# EAGLE design Push-It-V1.0 (EAGLE 9.4.2)
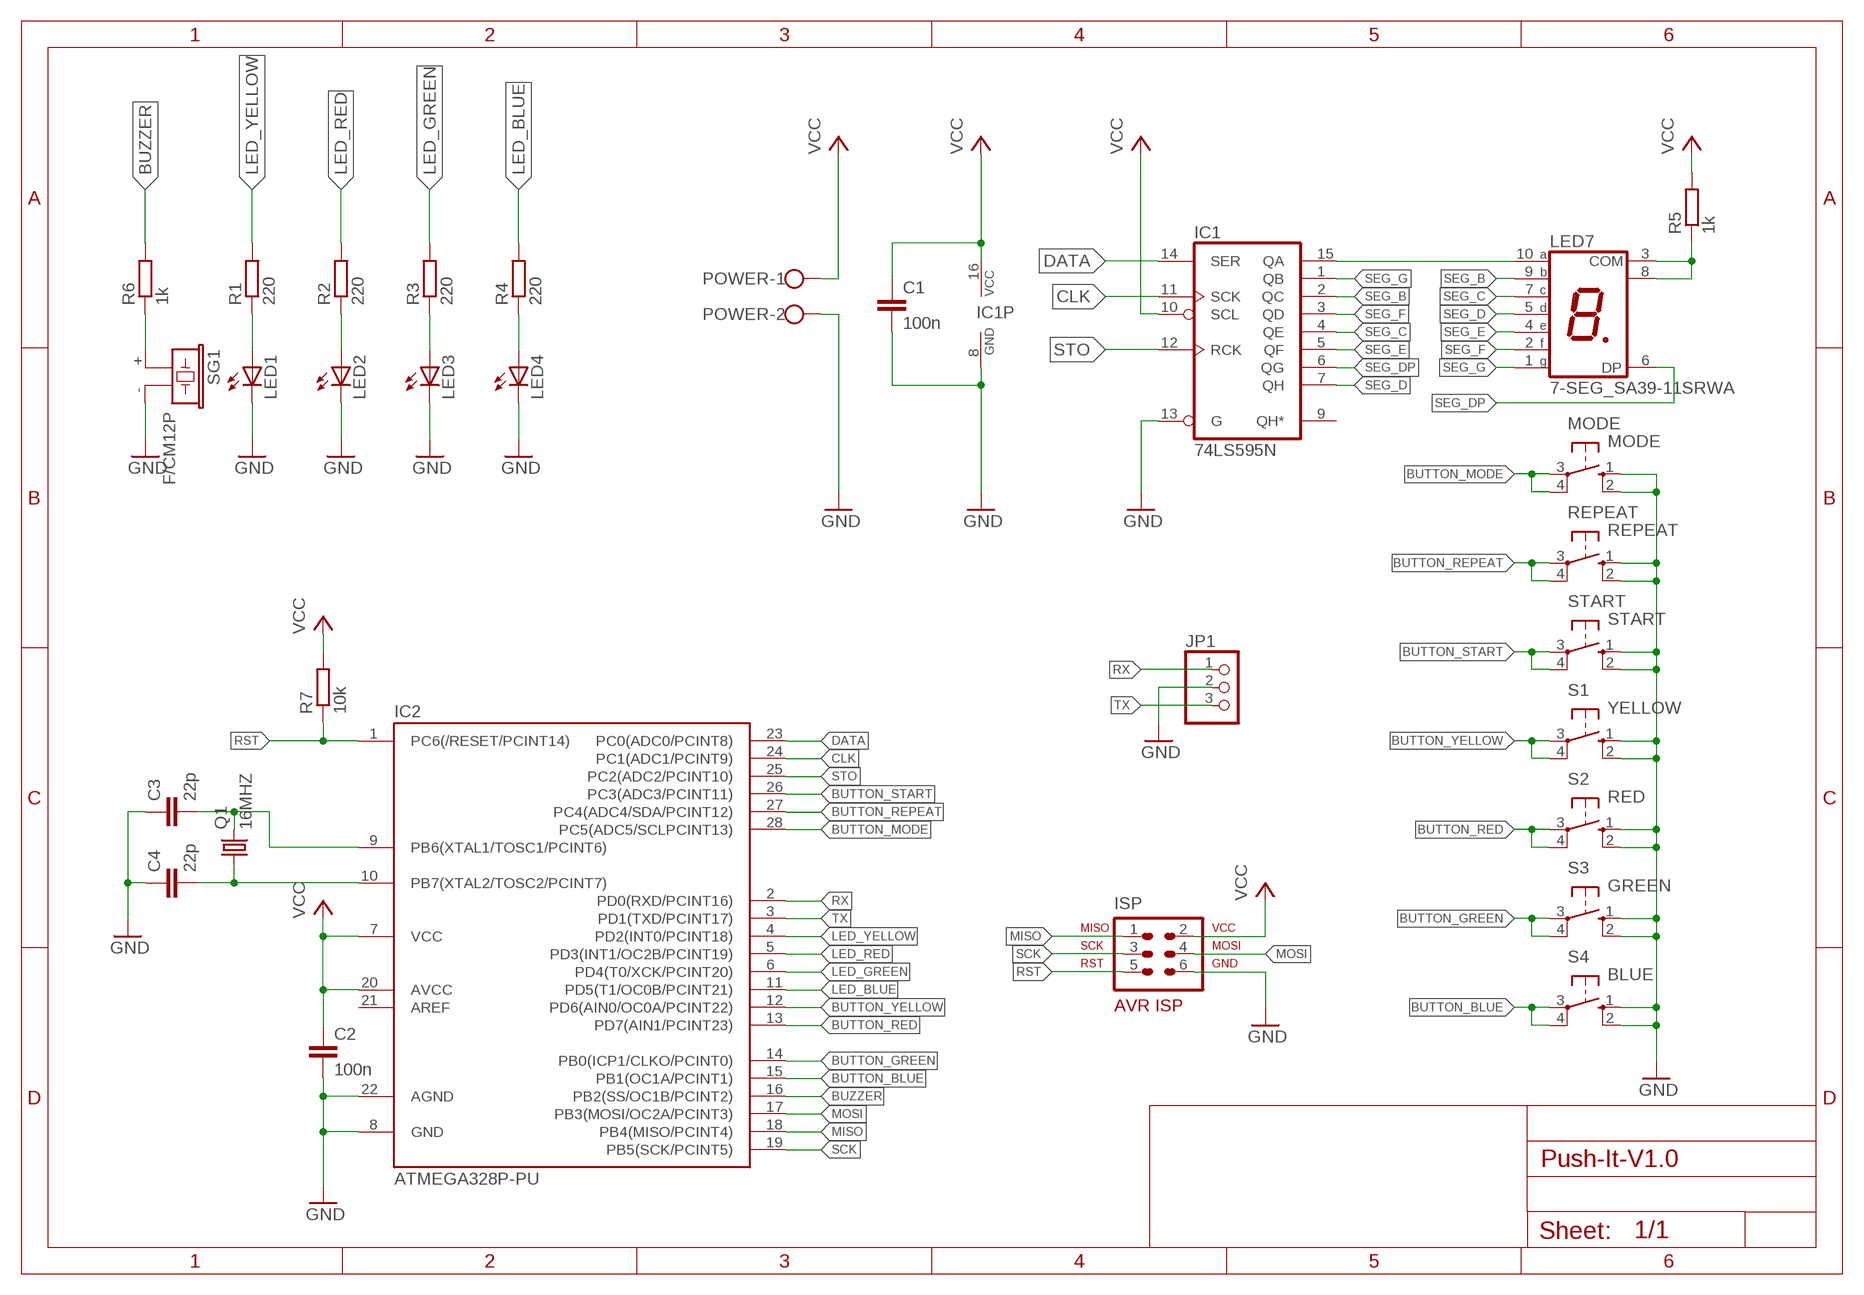
[diagram p0: schematic, sheet 1]

## Parts
C1  100n  C-EU025-025X050  [C025-025X050]
C2  100n  C-EU025-025X050  [C025-025X050]
C3  22p  C-EU025-025X050  [C025-025X050]
C4  22p  C-EU025-025X050  [C025-025X050]
IC1  74LS595N  [DIL16]
IC2  ATMEGA328P-PU  MEGA48/88/168-PU  [DIL28-3]
ISP  AVR-ISP-6VERT  [AVR-ISP-6]
JP1  PINHD-1X3/90  [1X03/90]
LED1  LED10MM  [LED10MM]
LED2  LED10MM  [LED10MM]
LED3  LED10MM  [LED10MM]
LED4  LED10MM  [LED10MM]
LED7  7-SEG_SA39-11SRWA  [SA39-11SRWA]
MODE  MODE  10-XX  [B3F-10XX]
POWER  W237-102  [W237-102]
Q1  16MHZ  CRYSTALHC49S  [HC49/S]
R1  220  R-EU_0207/7  [0207/7]
R2  220  R-EU_0207/7  [0207/7]
R3  220  R-EU_0207/7  [0207/7]
R4  220  R-EU_0207/7  [0207/7]
R5  1k  R-EU_0207/7  [0207/7]
R6  1k  R-EU_0207/7  [0207/7]
R7  10k  R-EU_0207/7  [0207/7]
REPEAT  REPEAT  10-XX  [B3F-10XX]
S1  YELLOW  10-XX  [B3F-10XX]
S2  RED  10-XX  [B3F-10XX]
S3  GREEN  10-XX  [B3F-10XX]
S4  BLUE  10-XX  [B3F-10XX]
SG1  F/CM12P  [F/CM12P]
START  START  10-XX  [B3F-10XX]

## Nets
BUTTON_BLUE: IC2.15(PB1(OC1A/PCINT1)) S4.3(P) S4.4(P1)
BUTTON_GREEN: IC2.14(PB0(ICP1/CLKO/PCINT0)) S3.3(P) S3.4(P1)
BUTTON_MODE: IC2.28(PC5(ADC5/SCLPCINT13)) MODE.3(P) MODE.4(P1)
BUTTON_RED: IC2.13(PD7(AIN1/PCINT23)) S2.3(P) S2.4(P1)
BUTTON_REPEAT: IC2.27(PC4(ADC4/SDA/PCINT12)) REPEAT.3(P) REPEAT.4(P1)
BUTTON_START: IC2.26(PC3(ADC3/PCINT11)) START.3(P) START.4(P1)
BUTTON_YELLOW: IC2.12(PD6(AIN0/OC0A/PCINT22)) S1.3(P) S1.4(P1)
BUZZER: IC2.16(PB2(SS/OC1B/PCINT2)) R6.2
CLK: IC1.11(SCK) IC2.24(PC1(ADC1/PCINT9))
DATA: IC1.14(SER) IC2.23(PC0(ADC0/PCINT8))
GND: C1.2 C2.2 C3.1 C4.1 IC1.8(GND) IC1.13(G) IC2.8(GND) IC2.22(AGND) ISP.6 JP1.2 LED1.K(C) LED2.K(C) LED3.K(C) LED4.K(C) MODE.1(S) MODE.2(S1) POWER.2 REPEAT.1(S) REPEAT.2(S1) S1.1(S) S1.2(S1) S2.1(S) S2.2(S1) S3.1(S) S3.2(S1) S4.1(S) S4.2(S1) SG1.- START.1(S) START.2(S1)
LED_BLUE: IC2.11(PD5(T1/OC0B/PCINT21)) R4.2
LED_GREEN: IC2.6(PD4(T0/XCK/PCINT20)) R3.2
LED_RED: IC2.5(PD3(INT1/OC2B/PCINT19)) R2.2
LED_YELLOW: IC2.4(PD2(INT0/PCINT18)) R1.2
MISO: IC2.18(PB4(MISO/PCINT4)) ISP.1
MOSI: IC2.17(PB3(MOSI/OC2A/PCINT3)) ISP.4
N$1: LED1.A R1.1
N$2: LED2.A R2.1
N$3: LED3.A R3.1
N$4: LED4.A R4.1
N$5: IC1.15(QA) LED7.10(A)
N$13: LED7.3(COM) LED7.8(COM) R5.1
N$14: C4.2 IC2.10(PB7(XTAL2/TOSC2/PCINT7)) Q1.1
N$15: C3.2 IC2.9(PB6(XTAL1/TOSC1/PCINT6)) Q1.2
N$16: R6.1 SG1.+
RST: IC2.1(PC6(/RESET/PCINT14)) ISP.5 R7.1
RX: IC2.2(PD0(RXD/PCINT16)) JP1.1
SCK: IC2.19(PB5(SCK/PCINT5)) ISP.3
SEG_B: IC1.2(QC) LED7.9(B)
SEG_C: IC1.4(QE) LED7.7(C)
SEG_D: IC1.7(QH) LED7.5(D)
SEG_DP: IC1.6(QG) LED7.6(DP)
SEG_E: IC1.5(QF) LED7.4(E)
SEG_F: IC1.3(QD) LED7.2(F)
SEG_G: IC1.1(QB) LED7.1(G)
STO: IC1.12(RCK) IC2.25(PC2(ADC2/PCINT10))
TX: IC2.3(PD1(TXD/PCINT17)) JP1.3
VCC: C1.1 C2.1 IC1.10(SCL) IC1.16(VCC) IC2.7(VCC) IC2.20(AVCC) ISP.2 POWER.1 R5.2 R7.2
Unconnected: IC1.9(QH*) IC2.21(AREF)

## Library data of the parts
C1-C4 = rcl:C-EU: CAPACITOR, European symbol
IC1 = 74xx-eu:74*595: 8-bit SHIFT REGISTER, output latch
IC2 = avr-6:MEGA48/88/168-PU
ISP = avr-7:AVR-ISP-6: AVR ISP-6 Serial Programming Header
JP1 = pinhead:PINHD-1X3: PIN HEADER
LED1-LED4 = led:LED: LED OSRAM: - CHIPLED LG R971, LG N971, LY N971, LG Q971, LY Q971, LO R971, LY R971 LH N974, LH R974 LS Q976, LO Q976, LY Q976 LO Q996 - Hyper CHIPLED LW Q18S LB Q993, LB Q99A, LB R99A - SideLED LS A670, LO A670, LY A670, LG A670, LP A670 LB A673, LV A673, LT A673, LW A673 LH A674 LY A675 LS A676, LA A676, LO A676, LY A676, LW A676 LS A679, LY A679, LG A679 - Hyper Micro SIDELED® LS Y876, LA Y876, LO Y876, LY Y876 LT Y87S - SmartLED LW L88C, LW L88S LB L89C, LB L89S, LG L890 LS L89K, LO L89K, LY L89K LS L896, LA L896, LO L896, LY L896 - TOPLED LS T670, LO T670, LY T670, LG T670, LP T670 LSG T670, LSP T670, LSY T670, LOP T670, LYG T670 LG T671, LOG T671, LSG T671 LB T673, LV T673, LT T673, LW T673 LH T674 LS T676, LA T676, LO T676, LY T676, LB T676, LH T676, LSB T676, LW T676 LB T67C, LV T67C, LT T67C, LS T67K, LO T67K, LY T67K, LW E67C LS E67B, LA E67B, LO E67B, LY E67B, LB E67C, LV E67C, LT E67C LW T67C LS T679, LY T679, LG T679 LS T770, LO T770, LY T770, LG T770, LP T770 LB T773, LV T773, LT T773, LW T773 LH T774 LS E675, LA E675, LY E675, LS T675 LS T776, LA T776, LO T776, LY T776, LB T776 LHGB T686 LT T68C, LB T68C - Hyper Mini TOPLED® LB M676 - Mini TOPLED Santana® LG M470 LS M47K, LO M47K, LY M47K Source: http://www.osram.convergy.de LUXEON: - LUMILED® LXK2-PW12-R00, LXK2-PW12-S00, LXK2-PW14-U00, LXK2-PW14-V00 LXK2-PM12-R00, LXK2-PM12-S00, LXK2-PM14-U00 LXK2-PE12-Q00, LXK2-PE12-R00, LXK2-PE12-S00, LXK2-PE14-T00, LXK2-PE14-U00 LXK2-PB12-K00, LXK2-PB12-L00, LXK2-PB12-M00, LXK2-PB14-N00, LXK2-PB14-P00, LXK2-PB14-Q00 LXK2-PR12-L00, LXK2-PR12-M00, LXK2-PR14-Q00, LXK2-PR14-R00 LXK2-PD12-Q00, LXK2-PD12-R00, LXK2-PD12-S00 LXK2-PH12-R00, LXK2-PH12-S00 LXK2-PL12-P00, LXK2-PL12-Q00, LXK2-PL12-R00 Source: www.luxeon.com KINGBRIGHT: KA-3528ASYC Source: www.kingbright.com
LED7 = display-kingbright-2:7-SEG_: Kingbright 14.2mm (0.56 INCH) SINGLE DIGIT NUMERIC DUISPLAY Source: SA56-11EWA(Ver1189471036.pdf
MODE REPEAT S1-S4 START = switch-omron:10-XX: OMRON SWITCH; MPN: B3F-1000; OC_FARNELL: 176432; OC_NEWARK: 36M3542
POWER = con-wago-500:W237-102: WAGO SCREW CLAMP; MPN: 237-102; OC_FARNELL: unknown; OC_NEWARK: 70K9898
Q1 = crystal:CRYSTAL: CRYSTAL; OC_FARNELL: 1667008; OC_NEWARK: unknown
R1-R7 = rcl:R-EU_: RESISTOR, European symbol
SG1 = buzzer:F/CM12P: BUZZER Source: Buerklin; OC_FARNELL: unknown; OC_NEWARK: unknown

## Board
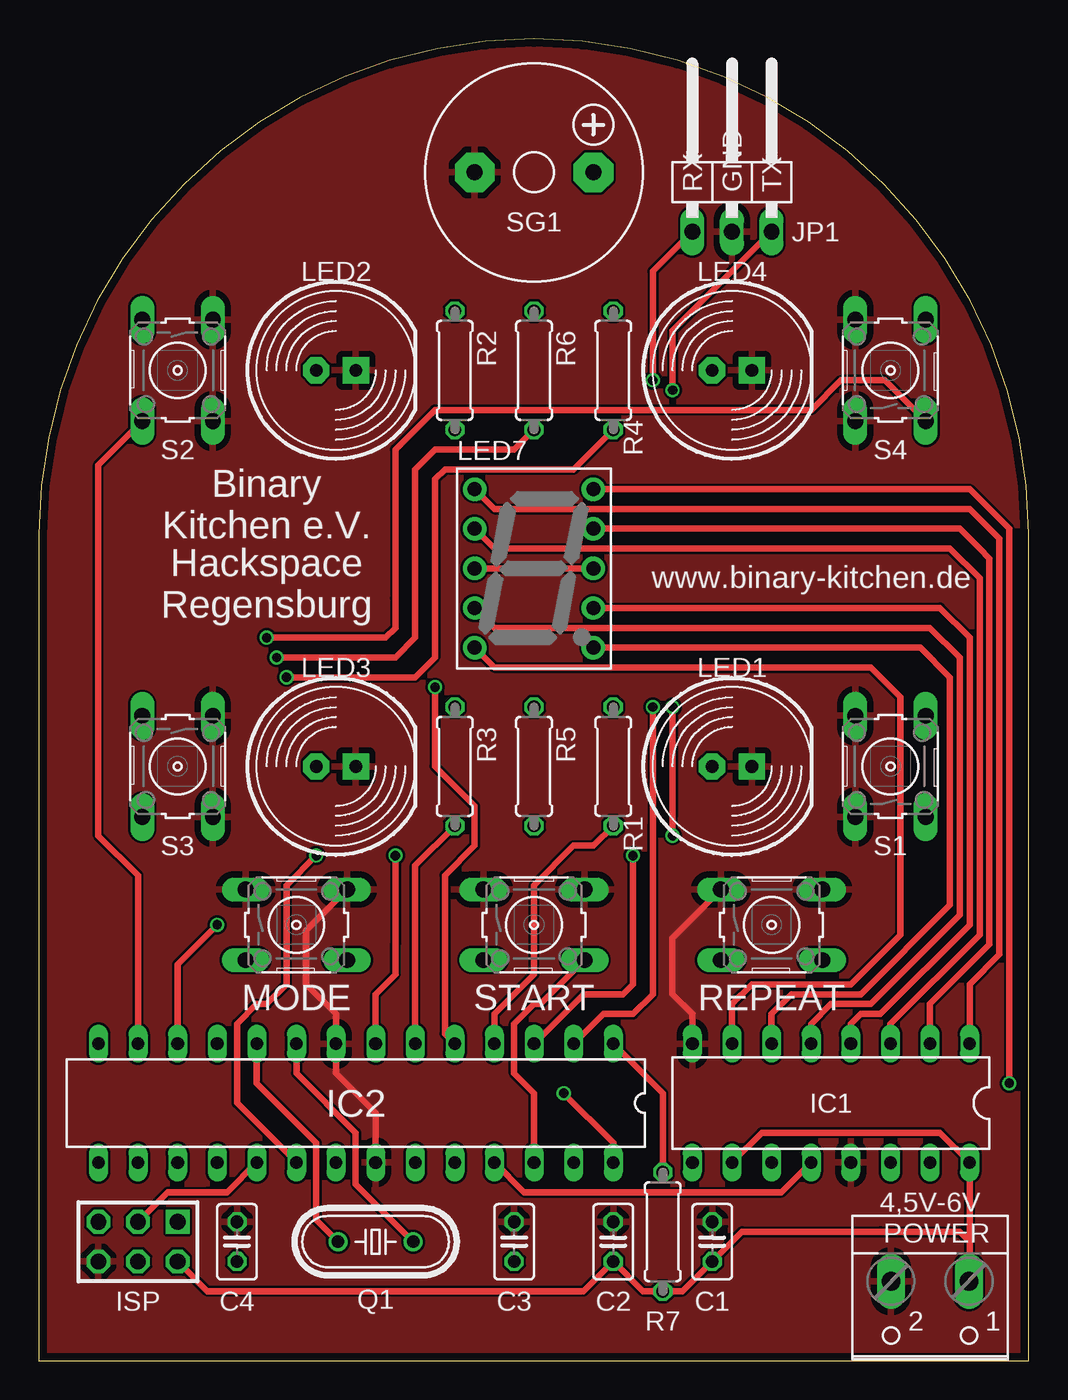
[diagram p1: board, top side]
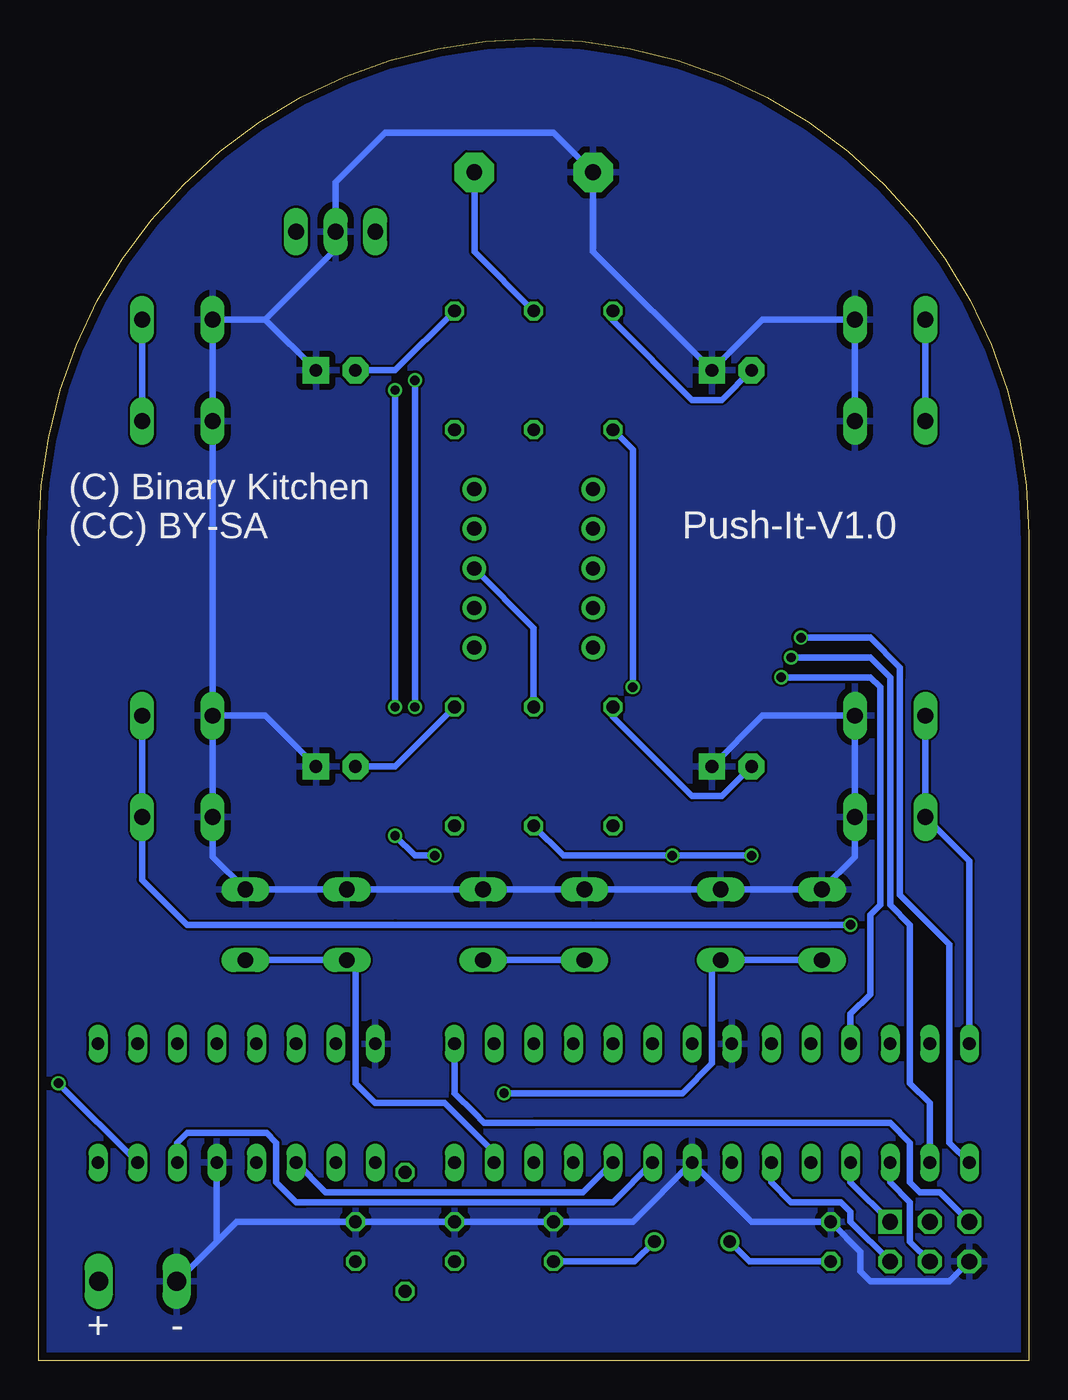
[diagram p2: board, bottom side, seen from below]

Size 63.48 x 84.75 mm. Coordinates in mm from the lower left corner, seen from the top.
Outline: 0,0 63.48,0 63.48,53.01 arc180 0,53.01 0,0
Copper layers (1*16): Top 0.035mm / dielectric 1.6mm / Bottom 0.035mm
Design rules "Elecrow_2-layer_PCB_eagle_rule *": minimum track width 6mil, minimum drill 12mil, track to track 6mil, track to pad 6mil, pad to pad 6mil, via to via 8mil, smd to smd 0mil, copper to edge 20mil, drill to drill 10mil, minimum pad ring 6mil, minimum via ring 6mil, stop-mask expansion 0mil, vias tented up to drill 100mil, thermal gap 16mil

### Footprints (pad centres in the part's own frame; a part is rotated, then mirrored left to right if it is on the bottom)
C025-025X050 = drill 0.813 octagon: 1 -1.27,0; 2 1.27,0
DIL16 = drill 0.813 long: 1 -8.89,-3.81; 2 -6.35,-3.81; 3 -3.81,-3.81; 4 -1.27,-3.81; 5 1.27,-3.81; 6 3.81,-3.81; 7 6.35,-3.81; 8 8.89,-3.81; 9 8.89,3.81; 10 6.35,3.81; 11 3.81,3.81; 12 1.27,3.81; 13 -1.27,3.81; 14 -3.81,3.81; 15 -6.35,3.81; 16 -8.89,3.81
DIL28-3 = drill 0.813 long: 1 -16.51,-3.81; 2 -13.97,-3.81; 3 -11.43,-3.81; 4 -8.89,-3.81; 5 -6.35,-3.81; 6 -3.81,-3.81; 7 -1.27,-3.81; 8 1.27,-3.81; 9 3.81,-3.81; 10 6.35,-3.81; 11 8.89,-3.81; 12 11.43,-3.81; 13 13.97,-3.81; 14 16.51,-3.81; 15 16.51,3.81; 16 13.97,3.81; 17 11.43,3.81; 18 8.89,3.81; 19 6.35,3.81; 20 3.81,3.81; 21 1.27,3.81; 22 -1.27,3.81; 23 -3.81,3.81; 24 -6.35,3.81; 25 -8.89,3.81; 26 -11.43,3.81; 27 -13.97,3.81; 28 -16.51,3.81
AVR-ISP-6 = drill 1.016 square: 1 -2.54,-1.27 | drill 1.016 octagon: 2 -2.54,1.27; 3 0,-1.27; 4 0,1.27; 5 2.54,-1.27; 6 2.54,1.27
1X03/90 = drill 1.016 long: 1 -2.54,-3.81; 2 0,-3.81; 3 2.54,-3.81
LED10MM = drill 0.813 pad 1.676 octagon: A -1.27,0 | drill 0.813 pad 1.676 square: K 1.27,0
SA39-11SRWA = drill 0.9 pad 1.5: 1 -3.81,5.08; 2 -3.81,2.54; 3 -3.81,0; 4 -3.81,-2.54; 5 -3.81,-5.08; 6 3.81,-5.08; 7 3.81,-2.54; 8 3.81,0; 9 3.81,2.54; 10 3.81,5.08
B3F-10XX = drill 1.016 long: 1 -3.251,2.261; 2 3.251,2.261; 3 -3.251,-2.261; 4 3.251,-2.261
W237-102 = drill 1.194 long: 1 -2.5,-1.27; 2 2.5,-1.27
HC49/S = drill 0.813: 1 -2.413,0; 2 2.413,0
0207/7 = drill 0.813 octagon: 1 -3.81,0; 2 3.81,0
F/CM12P = drill 1.016 pad 2.54 octagon: + 3.81,0; - -3.81,0

### Placement (x,y rotation side)
C1  43.18,7.62 90 top
C2  36.83,7.62 90 top
C3  30.48,7.62 270 top
C4  12.7,7.62 270 top
IC1  50.8,16.51 180 top
IC2  20.32,16.51 180 top
ISP  6.35,7.62 180 top
JP1  44.45,76.2 0 top
LED1  44.45,38.1 0 top
LED2  19.05,63.5 0 top
LED3  19.05,38.1 0 top
LED4  44.45,63.5 0 top
LED7  31.75,50.8 0 top
MODE  16.51,27.94 0 top
POWER  57.15,3.81 180 top
Q1  21.59,7.62 0 top
R1  36.83,38.1 270 top
R2  26.67,63.5 270 top
R3  26.67,38.1 270 top
R4  36.83,63.5 270 top
R5  31.75,38.1 270 top
R6  31.75,63.5 270 top
R7  40.01,8.26 270 top
REPEAT  46.99,27.94 0 top
S1  54.61,38.1 90 top
S2  8.89,63.5 270 top
S3  8.89,38.1 270 top
S4  54.61,63.5 90 top
SG1  31.75,76.2 0 top
START  31.75,27.94 0 top

### Tracks (layer width: path | path; a pad name or v marks a point on that pad's centre or on a via)
BUTTON_BLUE  (via drill 0.6)
  Top 0.406: S4.3 54.25,62.87 52.7,62.87 51.44,62.87 49.53,60.96 37.47,60.96 25.4,60.96 22.86,58.42 22.86,48.9 22.86,46.99 22.23,46.35 v14.61,46.35
  Bottom 0.406: S4.4 S4.3 | IC2.15 5.08,13.97 5.08,26.67 8.26,29.84 8.26,43.81 8.26,44.45 10.16,46.35 v14.61,46.35
BUTTON_GREEN
  Bottom 0.406: S3.3 S3.4 3.81,32.03 IC2.14
BUTTON_MODE  (via drill 0.6)
  Top 0.406: v33.66,17.14 36.83,13.97 IC2.28
  Bottom 0.406: MODE.3 MODE.4 20.32,25.12 20.32,19.68 20.32,19.05 22.23,17.14 29.21,17.14 v33.66,17.14
BUTTON_RED
  Top 0.406: IC2.13 6.35,31.11 3.81,33.66 3.81,57.43 S2.4
  Bottom 0.406: S2.3 S2.4
BUTTON_REPEAT
  Bottom 0.406: REPEAT.4 REPEAT.3 43.18,25.12 43.18,17.78 41.91,16.51 37.47,16.51 34.29,13.34 IC2.27
BUTTON_START
  Top 0.406: IC2.26 31.75,17.14 30.48,18.41 30.48,21.59 31.75,22.86 32.18,22.86 START.4
  Bottom 0.406: START.3 START.4
BUTTON_YELLOW  (via drill 0.6)
  Top 0.406: IC2.12 8.89,25.4 v11.43,27.94
  Bottom 0.406: S1.4 S1.3 56.87,30.84 53.98,27.94 40.64,27.94 27.94,27.94 12.7,27.94 v11.43,27.94
BUZZER  (via drill 0.6)
  Top 0.406: R6.2 30.48,58.42 25.4,58.42 24.13,57.15 24.13,48.26 24.13,46.35 22.86,45.09 v15.24,45.09
  Bottom 0.406: IC2.16 6.35,16.51 7.62,17.78 7.62,27.3 7.62,27.94 8.89,29.21 8.89,43.81 10.16,45.09 v15.24,45.09
CLK
  Bottom 0.406: IC2.24 28.57,10.79 29.21,10.79 45.09,10.79 IC1.11
DATA
  Bottom 0.406: IC2.23 26.67,10.16 46.35,10.16 46.99,10.16 48.26,11.43 48.26,12.06 48.26,13.34 48.26,13.97 48.9,14.61 53.98,14.61 54.61,13.97 IC1.14
GND
  Top 0.406: REPEAT.1 40.64,27.1 40.64,23.5 41.91,22.23 IC1.8 | IC2.22 21.59,15.88 19.05,18.41 IC2.8 19.05,22.23 17.14,24.13 17.14,27.58 MODE.2
  Bottom 0.406: S1.2 S1.1 52.35,32.31 REPEAT.2 REPEAT.1 START.2 START.1 MODE.2 MODE.1 11.15,32.31 S3.2 S3.1 17.07,41.35 LED3.K | S2.2 S2.1 17.07,66.75 LED2.K 27.94,71.12 SG1.- 30.48,78.74 35.56,78.74 38.1,78.74 41.27,78.74 44.45,75.56 JP1.2 44.45,71.27 48.97,66.75 | 48.97,66.75 S4.2 S4.1 S1.2 | 48.97,66.75 LED4.K | S1.2 48.97,41.35 LED1.K | POWER.2 54.61,5.08 52.07,7.62 | 52.07,7.62 52.07,8.26 IC1.13 | ISP.6 5.08,5.08 8.26,5.08 10.16,5.08 10.79,5.71 10.79,6.99 C4.1 17.78,8.89 IC2.22 25.4,8.89 C3.1 C2.2 C1.2 50.8,8.89 52.07,7.62
  pour Bottom: 0,0 63.5,0 63.5,52.7 arc180 0,52.7
  pour Top: 0,0 63.5,0 63.5,52.7 arc180 0,52.7
LED_BLUE  (via drill 0.6)
  Top 0.406: R4.2 34.29,57.15 26.04,57.15 25.4,56.52 25.4,45.09 24.13,43.81 v15.88,43.81
  Bottom 0.406: IC2.11 11.43,22.23 10.16,23.5 10.16,27.3 10.16,28.57 9.53,29.21 9.53,41.91 9.53,43.18 10.16,43.81 12.7,43.81 v15.88,43.81
LED_GREEN
  Top 0.406: IC2.6 24.13,31.75 R3.2
LED_RED  (via drill 0.6)
  Top 0.406: v25.4,43.18 25.4,38.1 27.94,35.56 27.94,33.02 26.04,31.11 26.04,20.95 IC2.5
  Bottom 0.406: R2.2 25.4,58.42 v25.4,43.18
LED_YELLOW
  Top 0.406: IC2.4 29.21,22.23 31.75,24.77 31.75,30.48 34.29,33.02 35.56,33.02 R1.2
MISO
  Bottom 0.406: ISP.1 11.43,11.43 IC2.18
MOSI
  Bottom 0.406: ISP.4 7.62,7.62 7.62,10.16 8.89,11.43 IC2.17
N$1
  Bottom 0.406: LED1.A 40.64,38.1 R1.1
N$2
  Bottom 0.406: LED2.A 19.68,61.59 21.59,61.59 26.67,66.67 R2.1
N$3
  Bottom 0.406: LED3.A 19.68,36.2 21.59,36.2 26.67,41.27 R3.1
N$4
  Bottom 0.406: LED4.A 40.64,63.5 R4.1
N$5  (via drill 0.6)
  Top 0.406: LED7.10 59.69,55.88 62.23,53.34 v62.23,17.78
  Bottom 0.406: v62.23,17.78 IC1.15
N$13
  Top 0.406: LED7.3 LED7.8
  Bottom 0.406: R5.1 31.75,46.99 LED7.8
N$14
  Top 0.406: IC2.10 13.97,17.78 17.78,13.97 17.78,9.02 Q1.1
  Bottom 0.406: C4.2 17.91,6.35 Q1.1
N$15
  Top 0.406: IC2.9 16.51,18.41 20.32,14.61 20.32,11.3 Q1.2
  Bottom 0.406: C3.2 25.27,6.35 Q1.2
N$16
  Bottom 0.406: R6.1 35.56,71.12 SG1.+
RST
  Top 0.406: R7.1 40.01,17.14 IC2.1
  Bottom 0.406: ISP.5 5.71,10.79 6.99,10.79 7.62,11.43 7.62,13.97 8.89,15.24 31.75,15.24 34.92,15.24 35.56,15.88 36.83,17.14 IC2.1
RX  (via drill 0.6)
  Top 0.406: JP1.1 39.37,69.85 v39.37,62.87 | v39.37,41.91 39.37,34.29 39.37,23.5 38.1,22.23 36.2,22.23 IC2.2
  Bottom 0.406: v39.37,62.87 39.37,43.18 v39.37,41.91
SCK
  Top 0.406: ISP.3 8.26,10.79 10.79,10.79 12.06,10.79 IC2.19
SEG_B
  Top 0.406: LED7.9 59.05,53.34 60.33,52.07 60.96,51.44 60.96,26.67 57.15,22.86 IC1.2
SEG_C
  Top 0.406: LED7.7 57.78,48.26 59.69,46.35 59.69,27.94 53.98,22.23 52.7,22.23 52.07,21.59 IC1.4
SEG_D
  Top 0.406: LED7.5 29.21,44.45 41.91,44.45 53.34,44.45 55.24,42.55 55.24,30.48 55.24,27.3 52.7,24.77 52.07,24.13 45.72,24.13 44.45,22.86 IC1.7
SEG_DP
  Top 0.406: LED7.6 56.52,45.72 58.42,43.81 58.42,30.48 58.42,29.21 52.7,23.5 48.26,23.5 46.99,22.23 IC1.6
SEG_E
  Top 0.406: LED7.4 29.21,46.99 55.24,46.99 57.15,46.99 59.05,45.09 59.05,29.84 59.05,28.57 53.34,22.86 50.8,22.86 49.53,21.59 IC1.5
SEG_F
  Top 0.406: LED7.2 29.21,52.07 58.42,52.07 60.33,50.16 60.33,36.2 60.33,27.3 54.61,21.59 IC1.3
SEG_G
  Top 0.406: LED7.1 29.21,54.61 59.69,54.61 61.59,52.7 61.59,42.55 61.59,29.21 61.59,26.04 59.69,24.13 IC1.1
STO
  Top 0.406: IC2.25 31.11,10.79 39.37,10.79 47.62,10.79 IC1.12
TX  (via drill 0.6)
  Top 0.406: JP1.3 40.64,66.04 v40.64,62.23 | v40.64,41.91 40.64,34.92 v40.64,33.66 | IC2.3 34.92,23.5 37.47,23.5 38.1,24.13 v38.1,32.38
  Bottom 0.406: v40.64,62.23 v40.64,41.91 | v38.1,32.38 39.37,32.38 v40.64,33.66
VCC  (via drill 0.6)
  Top 0.406: POWER.1 59.69,5.12 59.69,7.62 | 59.69,7.62 59.69,8.26 IC1.16 57.78,14.61 50.8,14.61 46.35,14.61 IC1.10 | ISP.2 10.79,4.45 13.97,4.45 34.92,4.45 C2.1 38.73,4.45 R7.2 41.27,4.45 C1.1 45.09,8.26 53.98,8.26 59.05,8.26 59.69,7.62 | IC2.20 12.7,16.51 12.7,20.32 12.7,21.59 13.97,22.86 14.61,22.86 15.88,24.13 15.88,30.48 v17.78,32.38 | IC2.7 21.59,23.5 22.86,24.77 22.86,26.67 v22.86,32.38
  Bottom 0.406: ISP.2 11.43,8.89 11.43,9.53 12.06,10.16 15.24,10.16 16.51,11.43 IC2.20 | R5.2 29.84,32.38 v22.86,32.38 v17.78,32.38

### Text on the board
tNames: RX | GND | TX | Binary / Kitchen e.V. | www.binary-kitchen.de | Hackspace / Regensburg | 4,5V-6V
bNames: Push-It-V1.0 | (C) Binary Kitchen / (CC) BY-SA | - | +